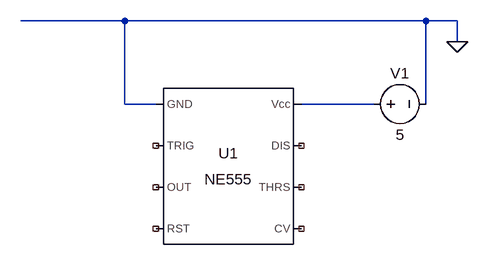
[diagram p0: schematic Draft1.asc]
Draft1.asc, the LTspice schematic file:
Version 4
SHEET 1 880 680
WIRE 64 -32 -96 -32
WIRE 528 -32 64 -32
WIRE 576 -32 528 -32
WIRE 576 0 576 -32
WIRE 64 96 64 -32
WIRE 112 96 64 96
WIRE 448 96 336 96
WIRE 528 96 528 -32
FLAG 576 0 0
SYMBOL Misc\\NE555 224 192 R0
SYMATTR InstName U1
SYMBOL voltage 432 96 R270
WINDOW 0 32 56 VTop 2
WINDOW 3 -32 56 VBottom 2
WINDOW 123 0 0 Left 0
WINDOW 39 0 0 Left 0
SYMATTR InstName V1
SYMATTR Value 5

The netlist it stands for:
* Draft1.asc
XU1 0 NC_01 NC_02 NC_03 NC_04 NC_05 NC_06 N001 NE555  ; pins GND TRIG OUT RST CV THRS DIS Vcc
V1 N001 0 5
.lib NE555.sub
.backanno
.end